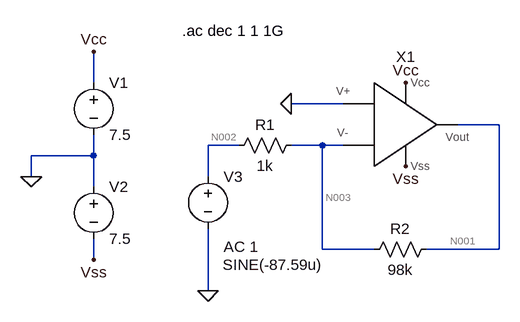
[diagram p0: schematic inversor.asc]
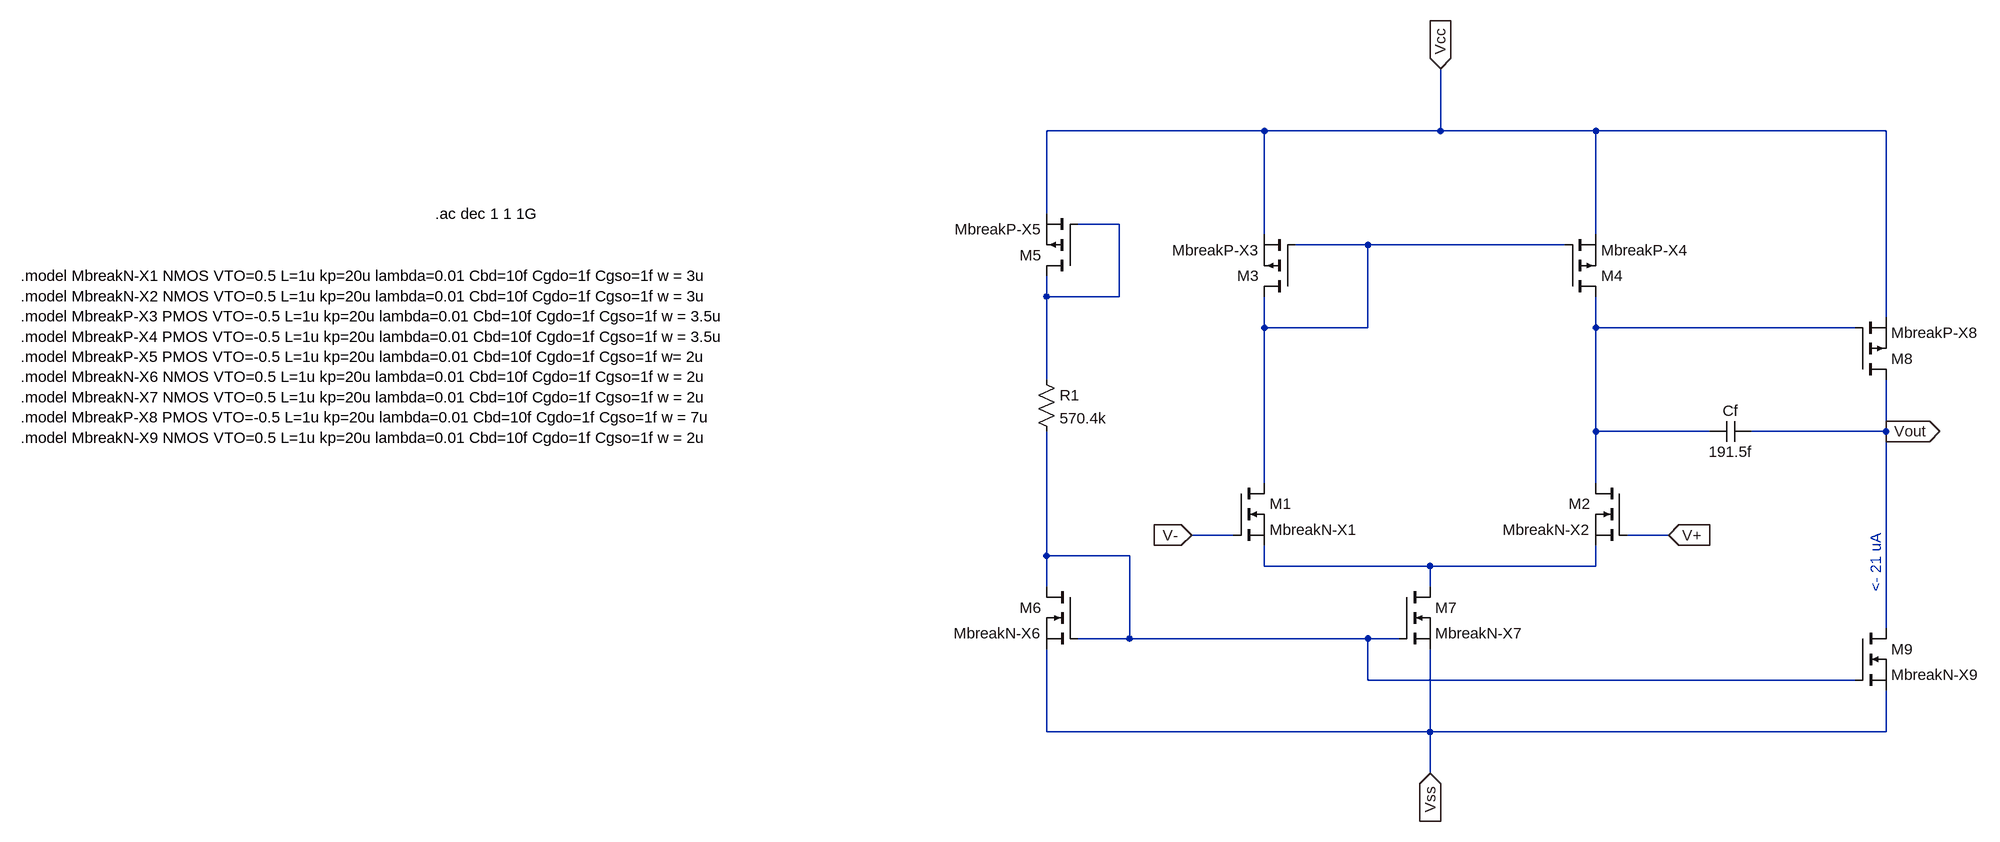
[diagram p1: sub-circuit icle7041.asc]
inversor.asc, the LTspice schematic file:
Version 4.1
SHEET 1 880 680
WIRE -272 80 -272 32
WIRE 112 112 32 112
WIRE 352 144 288 144
WIRE -48 176 -96 176
WIRE 80 176 32 176
WIRE 112 176 80 176
WIRE -272 192 -272 160
WIRE -272 192 -368 192
WIRE -368 224 -368 192
WIRE -96 224 -96 176
WIRE -272 240 -272 192
WIRE 80 336 80 176
WIRE 160 336 80 336
WIRE 352 336 352 144
WIRE 352 336 240 336
WIRE -272 352 -272 320
WIRE -96 400 -96 304
FLAG -272 32 Vcc
FLAG -272 352 Vss
FLAG -368 224 0
FLAG -96 400 0
FLAG 32 112 0
FLAG 208 208 Vss
FLAG 208 80 Vcc
SYMBOL ICLE7041 320 144 R0
SYMATTR InstName X1
SYMBOL voltage -272 64 R0
WINDOW 123 0 0 Left 0
WINDOW 39 0 0 Left 0
SYMATTR InstName V1
SYMATTR Value 7.5
SYMBOL voltage -272 224 R0
WINDOW 123 0 0 Left 0
WINDOW 39 0 0 Left 0
SYMATTR InstName V2
SYMATTR Value 7.5
SYMBOL res 48 160 R90
WINDOW 0 0 56 VBottom 2
WINDOW 3 32 56 VTop 2
SYMATTR InstName R1
SYMATTR Value 1k
SYMBOL res 256 320 R90
WINDOW 0 0 56 VBottom 2
WINDOW 3 32 56 VTop 2
SYMATTR InstName R2
SYMATTR Value 98k
SYMBOL voltage -96 208 R0
WINDOW 3 23 152 Left 2
WINDOW 123 24 124 Left 2
WINDOW 39 0 0 Left 0
SYMATTR Value SINE(-87.59u)
SYMATTR Value2 AC 1
SYMATTR InstName V3
TEXT -136 0 Left 2 !.ac dec 1 1 1G

icle7041.asc, the sub-circuit schematic file:
Version 4.1
SHEET 1 3020 808
WIRE 1216 -640 880 -640
WIRE 1488 -640 1488 -736
WIRE 1488 -640 1216 -640
WIRE 1728 -640 1488 -640
WIRE 2176 -640 1728 -640
WIRE 880 -512 880 -640
WIRE 992 -496 928 -496
WIRE 1216 -480 1216 -640
WIRE 1728 -480 1728 -640
WIRE 1376 -464 1264 -464
WIRE 1680 -464 1376 -464
WIRE 880 -384 880 -416
WIRE 992 -384 992 -496
WIRE 992 -384 880 -384
WIRE 2176 -352 2176 -640
WIRE 1216 -336 1216 -384
WIRE 1376 -336 1376 -464
WIRE 1376 -336 1216 -336
WIRE 1728 -336 1728 -384
WIRE 2128 -336 1728 -336
WIRE 880 -256 880 -384
WIRE 1728 -176 1728 -336
WIRE 1904 -176 1728 -176
WIRE 2176 -176 2176 -256
WIRE 2176 -176 1968 -176
WIRE 1216 -96 1216 -336
WIRE 1728 -96 1728 -176
WIRE 1168 -16 1104 -16
WIRE 1840 -16 1776 -16
WIRE 880 16 880 -176
WIRE 1008 16 880 16
WIRE 1216 32 1216 0
WIRE 1472 32 1216 32
WIRE 1728 32 1728 0
WIRE 1728 32 1472 32
WIRE 880 64 880 16
WIRE 1472 64 1472 32
WIRE 2176 128 2176 -176
WIRE 1008 144 1008 16
WIRE 1008 144 928 144
WIRE 1376 144 1008 144
WIRE 1424 144 1376 144
WIRE 1376 208 1376 144
WIRE 2128 208 1376 208
WIRE 880 288 880 160
WIRE 1472 288 1472 160
WIRE 1472 288 880 288
WIRE 2176 288 2176 224
WIRE 2176 288 1472 288
WIRE 1472 352 1472 288
FLAG 1840 -16 V+
IOPIN 1840 -16 In
FLAG 1104 -16 V-
IOPIN 1104 -16 In
FLAG 1488 -736 Vcc
IOPIN 1488 -736 In
FLAG 1472 352 Vss
IOPIN 1472 352 In
FLAG 2176 -176 Vout
IOPIN 2176 -176 Out
DATAFLAG 2176 -176 ""
SYMBOL pmos 928 -416 R180
SYMATTR InstName M5
SYMATTR Value MbreakP-X5
SYMBOL res 864 -272 R0
SYMATTR InstName R1
SYMATTR Value 570.4k
SYMBOL nmos 928 64 M0
SYMATTR InstName M6
SYMATTR Value MbreakN-X6
SYMBOL nmos 1424 64 R0
SYMATTR InstName M7
SYMATTR Value MbreakN-X7
SYMBOL nmos 1168 -96 R0
SYMATTR InstName M1
SYMATTR Value MbreakN-X1
SYMBOL nmos 1776 -96 M0
SYMATTR InstName M2
SYMATTR Value MbreakN-X2
SYMBOL pmos 2128 -256 M180
SYMATTR InstName M8
SYMATTR Value MbreakP-X8
SYMBOL nmos 2128 128 R0
SYMATTR InstName M9
SYMATTR Value MbreakN-X9
SYMBOL pmos 1264 -384 R180
SYMATTR InstName M3
SYMATTR Value MbreakP-X3
SYMBOL pmos 1680 -384 M180
SYMATTR InstName M4
SYMATTR Value MbreakP-X4
SYMBOL cap 1968 -192 R90
WINDOW 0 0 32 VBottom 2
WINDOW 3 32 32 VTop 2
SYMATTR InstName Cf
SYMATTR Value 191.5f
TEXT -704 -416 Left 2 !.model MbreakN-X1 NMOS VTO=0.5 L=1u kp=20u lambda=0.01 Cbd=10f Cgdo=1f Cgso=1f w = 3u\n.model MbreakN-X2 NMOS VTO=0.5 L=1u kp=20u lambda=0.01 Cbd=10f Cgdo=1f Cgso=1f w = 3u\n.model MbreakP-X3 PMOS VTO=-0.5 L=1u kp=20u lambda=0.01 Cbd=10f Cgdo=1f Cgso=1f w = 3.5u\n.model MbreakP-X4 PMOS VTO=-0.5 L=1u kp=20u lambda=0.01 Cbd=10f Cgdo=1f Cgso=1f w = 3.5u\n.model MbreakP-X5 PMOS VTO=-0.5 L=1u kp=20u lambda=0.01 Cbd=10f Cgdo=1f Cgso=1f w= 2u\n.model MbreakN-X6 NMOS VTO=0.5 L=1u kp=20u lambda=0.01 Cbd=10f Cgdo=1f Cgso=1f w = 2u\n.model MbreakN-X7 NMOS VTO=0.5 L=1u kp=20u lambda=0.01 Cbd=10f Cgdo=1f Cgso=1f w = 2u\n.model MbreakP-X8 PMOS VTO=-0.5 L=1u kp=20u lambda=0.01 Cbd=10f Cgdo=1f Cgso=1f w = 7u\n.model MbreakN-X9 NMOS VTO=0.5 L=1u kp=20u lambda=0.01 Cbd=10f Cgdo=1f Cgso=1f w = 2u
TEXT 2160 72 VLeft 2 ;<- 21 uA
TEXT -64 -512 Left 2 !.ac dec 1 1 1G

The netlist it stands for:
* inversor.asc
X§X1 0 N003 Vcc Vss N001 icle7041
V1 Vcc 0 7.5
V2 0 Vss 7.5
R1 N003 N002 1k
R2 N001 N003 98k
V3 N002 0 SINE(-87.59u) AC 1

* block symbol definitions
.subckt icle7041 V+ V- Vcc Vss Vout
M5 N001 N001 Vcc Vcc MbreakP-X5
R1 N001 N004 570.4k
M6 N004 N004 Vss Vss MbreakN-X6
M7 N005 N004 Vss Vss MbreakN-X7
M1 N002 V- N005 N005 MbreakN-X1
M2 N003 V+ N005 N005 MbreakN-X2
M8 Vout N003 Vcc Vcc MbreakP-X8
M9 Vout N004 Vss Vss MbreakN-X9
M3 N002 N002 Vcc Vcc MbreakP-X3
M4 N003 N002 Vcc Vcc MbreakP-X4
Cf Vout N003 191.5f
.model MbreakN-X1 NMOS VTO=0.5 L=1u kp=20u lambda=0.01 Cbd=10f Cgdo=1f Cgso=1f w = 3u
.model MbreakN-X2 NMOS VTO=0.5 L=1u kp=20u lambda=0.01 Cbd=10f Cgdo=1f Cgso=1f w = 3u
.model MbreakP-X3 PMOS VTO=-0.5 L=1u kp=20u lambda=0.01 Cbd=10f Cgdo=1f Cgso=1f w = 3.5u
.model MbreakP-X4 PMOS VTO=-0.5 L=1u kp=20u lambda=0.01 Cbd=10f Cgdo=1f Cgso=1f w = 3.5u
.model MbreakP-X5 PMOS VTO=-0.5 L=1u kp=20u lambda=0.01 Cbd=10f Cgdo=1f Cgso=1f w= 2u
.model MbreakN-X6 NMOS VTO=0.5 L=1u kp=20u lambda=0.01 Cbd=10f Cgdo=1f Cgso=1f w = 2u
.model MbreakN-X7 NMOS VTO=0.5 L=1u kp=20u lambda=0.01 Cbd=10f Cgdo=1f Cgso=1f w = 2u
.model MbreakP-X8 PMOS VTO=-0.5 L=1u kp=20u lambda=0.01 Cbd=10f Cgdo=1f Cgso=1f w = 7u
.model MbreakN-X9 NMOS VTO=0.5 L=1u kp=20u lambda=0.01 Cbd=10f Cgdo=1f Cgso=1f w = 2u
* <- 21 uA
.ac dec 1 1 1G
.ends icle7041

.model NMOS NMOS
.model PMOS PMOS
.lib standard.mos
.ac dec 1 1 1G
.backanno
.end

* Results of the author's LTspice run, read from the files saved beside the schematic
* Operating Point, zero values left out:
*   V(vcc) = 7.5 V
*   V(n001) = 15.38 mV
*   V(n002) = -87.59 µV
*   V(n003) = 68.65 µV
*   V(vss) = -7.5 V
*   I(V2) = -65.19 µA
*   I(R1) = 156.2 nA
*   I(V3) = 156.2 nA
*   I(V1) = -65.35 µA
*   I(R2) = 156.2 nA
*   Ix(x1:vcc) = 65.35 µA
*   Ix(x1:vss) = -65.19 µA
*   Ix(x1:vout) = -156.2 nA
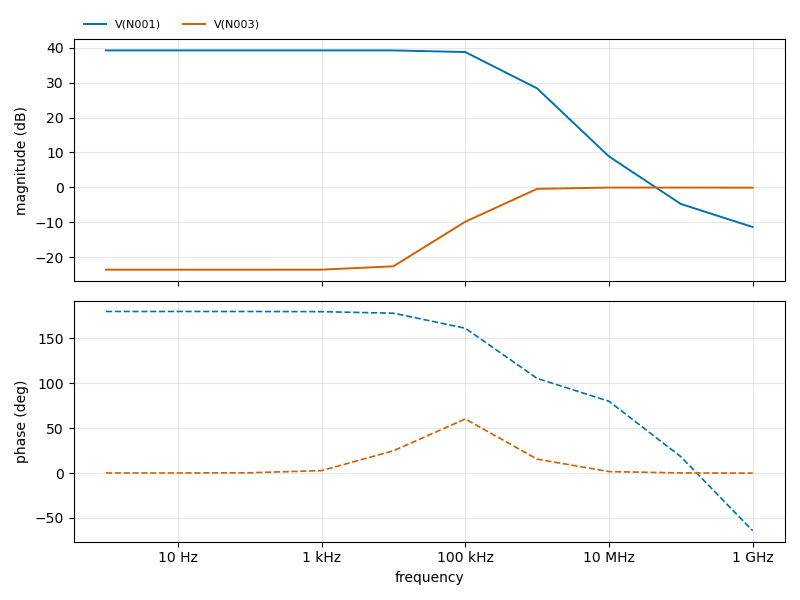
[diagram p2: AC Analysis of inversor.asc, plotted from the saved traces]
* AC Analysis, 1 run:
*   V(N001): 39.22 dB at 1 Hz, -11.34 dB at 1 GHz, peak 39.22 dB at 1 Hz, 3 dB below the peak at 175.7 kHz
*   V(N003): -23.55 dB at 1 Hz, -0.08 dB at 1 GHz, peak -0.04 dB at 100 MHz, 3 dB below the peak at 524.2 kHz